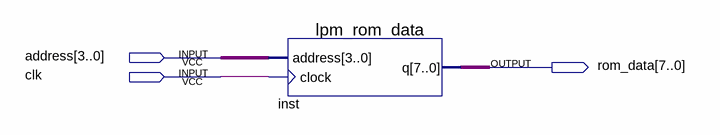
[diagram p0: schematic sheet]
// Quartus schematic ROM_data.bdf as structural Verilog: 1 symbols, 3 pins
module ROM_data (
  input  [3:0] address,
  input  clk,
  output [7:0] rom_data
);

  lpm_rom_data inst (.address(address), .clock(clk), .q(rom_data));
endmodule
